# EAGLE schematic Bot (EAGLE 5.11)
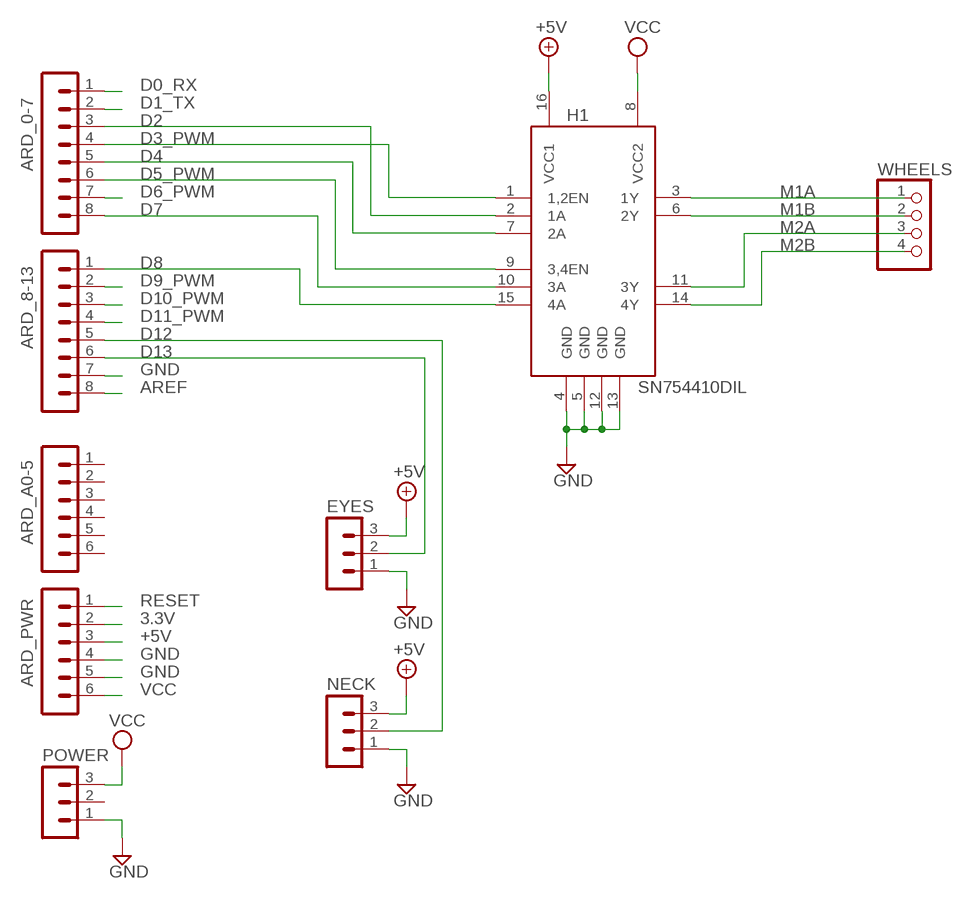
[diagram p0: schematic, sheet 1]

## Parts
ARD_0-7  MA08-1  [MA08-1]
ARD_8-13  MA08-1  [MA08-1]
ARD_A0-5  MA06-1  [MA06-1]
ARD_PWR  MA06-1  [MA06-1]
EYES  MA03-1  [MA03-1]
H1  SN754410DIL  [DIL16]
NECK  MA03-1  [MA03-1]
POWER  MA03-1  [MA03-1]
WHEELS  PINHD-1X4  [1X04]

## Nets
3.3V: ARD_PWR.2
+5V: ARD_PWR.3 EYES.3 H1.16(VCC1) NECK.3
AREF: ARD_8-13.8
D0_RX: ARD_0-7.1
D1_TX: ARD_0-7.2
D2: ARD_0-7.4 H1.1(1,2EN)
D3_PWM: ARD_0-7.3 H1.2(1A)
D4: H1.7(2A)
D5_PWM: H1.9(3,4EN)
D6_PWM: ARD_0-7.7
D7: ARD_0-7.8 H1.10(3A)
D8: ARD_8-13.1 H1.15(4A)
D9_PWM: ARD_8-13.2
D10_PWM: ARD_8-13.3
D11_PWM: ARD_8-13.4
D12: ARD_8-13.5 NECK.2
D13: ARD_8-13.6 EYES.2
GND: ARD_8-13.7 ARD_PWR.4 ARD_PWR.5 EYES.1 H1.4(GND) H1.5(GND) H1.12(GND) H1.13(GND) NECK.1 POWER.1
M1A: H1.3(1Y) WHEELS.1
M1B: H1.6(2Y) WHEELS.2
M2A: H1.11(3Y) WHEELS.3
M2B: H1.14(4Y) WHEELS.4
RESET: ARD_PWR.1
VCC: ARD_PWR.6 H1.8(VCC2) POWER.3
Unconnected: ARD_0-7.5 ARD_0-7.6 ARD_A0-5.1 ARD_A0-5.2 ARD_A0-5.3 ARD_A0-5.4 ARD_A0-5.5 ARD_A0-5.6 POWER.2

## Library data of the parts
ARD_0-7 ARD_8-13 = con-lstb:MA08-1: PIN HEADER; OC_FARNELL: unknown; OC_NEWARK: unknown
ARD_A0-5 ARD_PWR = con-lstb:MA06-1: PIN HEADER; OC_FARNELL: unknown; OC_NEWARK: unknown
EYES NECK POWER = con-lstb:MA03-1: PIN HEADER; OC_FARNELL: unknown; OC_NEWARK: unknown
H1 = BotParts:SN754410: Quadruple Half-H Driver
WHEELS = pinhead:PINHD-1X4: PIN HEADER